# EAGLE schematic FTHR-Modified Schematic (EAGLE 9.6.2)
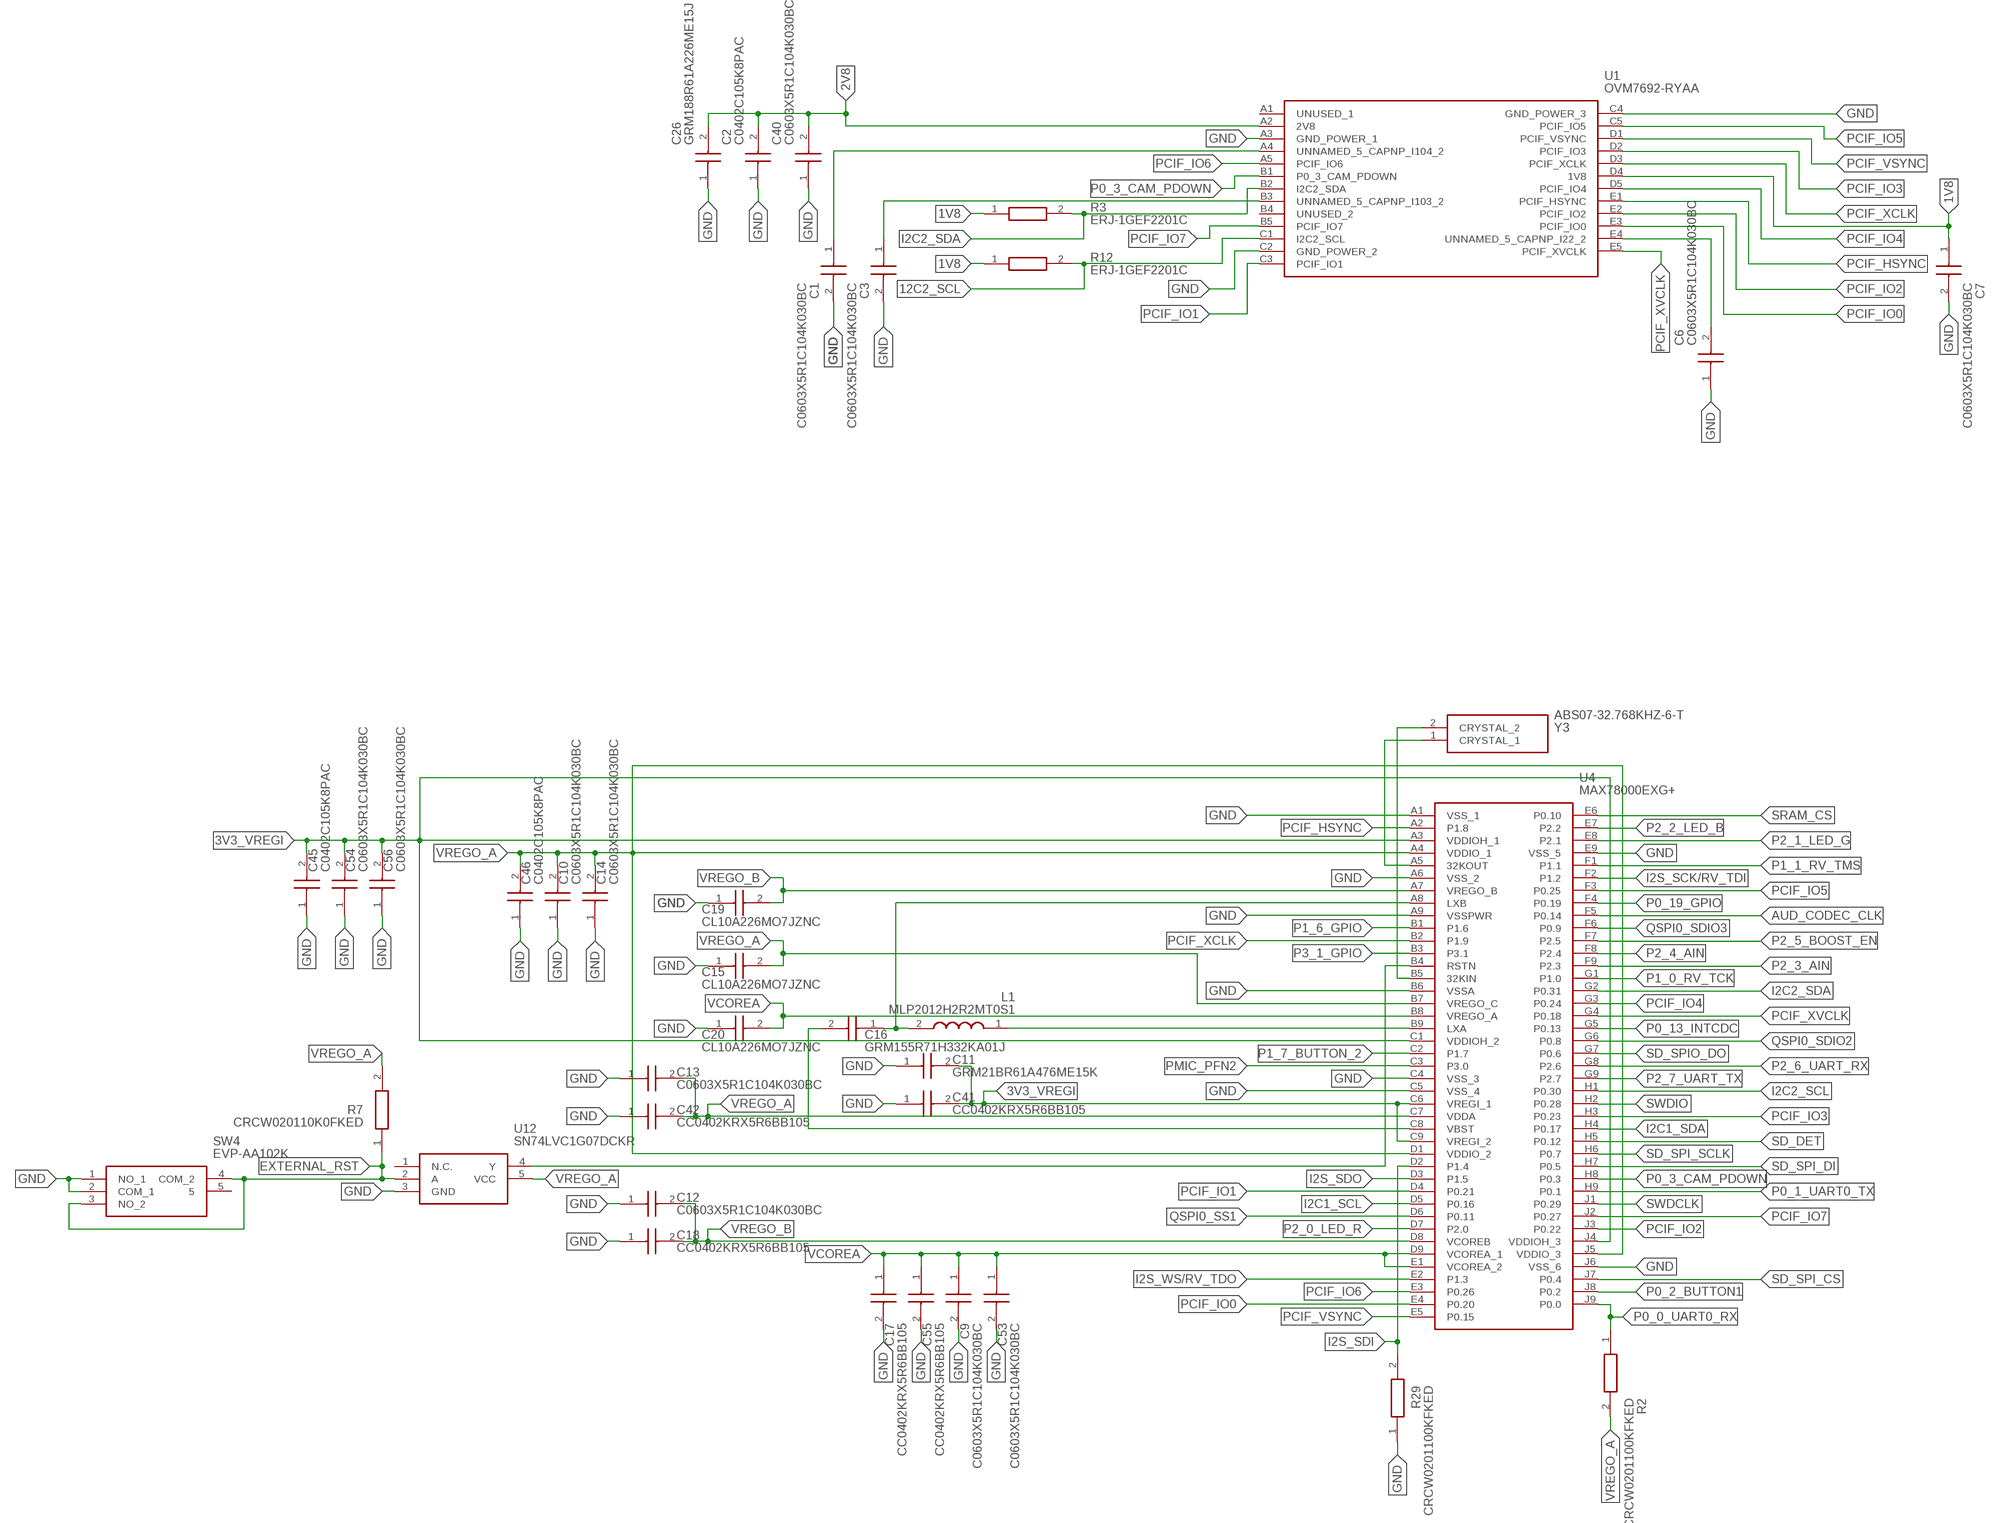
[diagram p0: schematic, sheet 1, part 1 of 3]
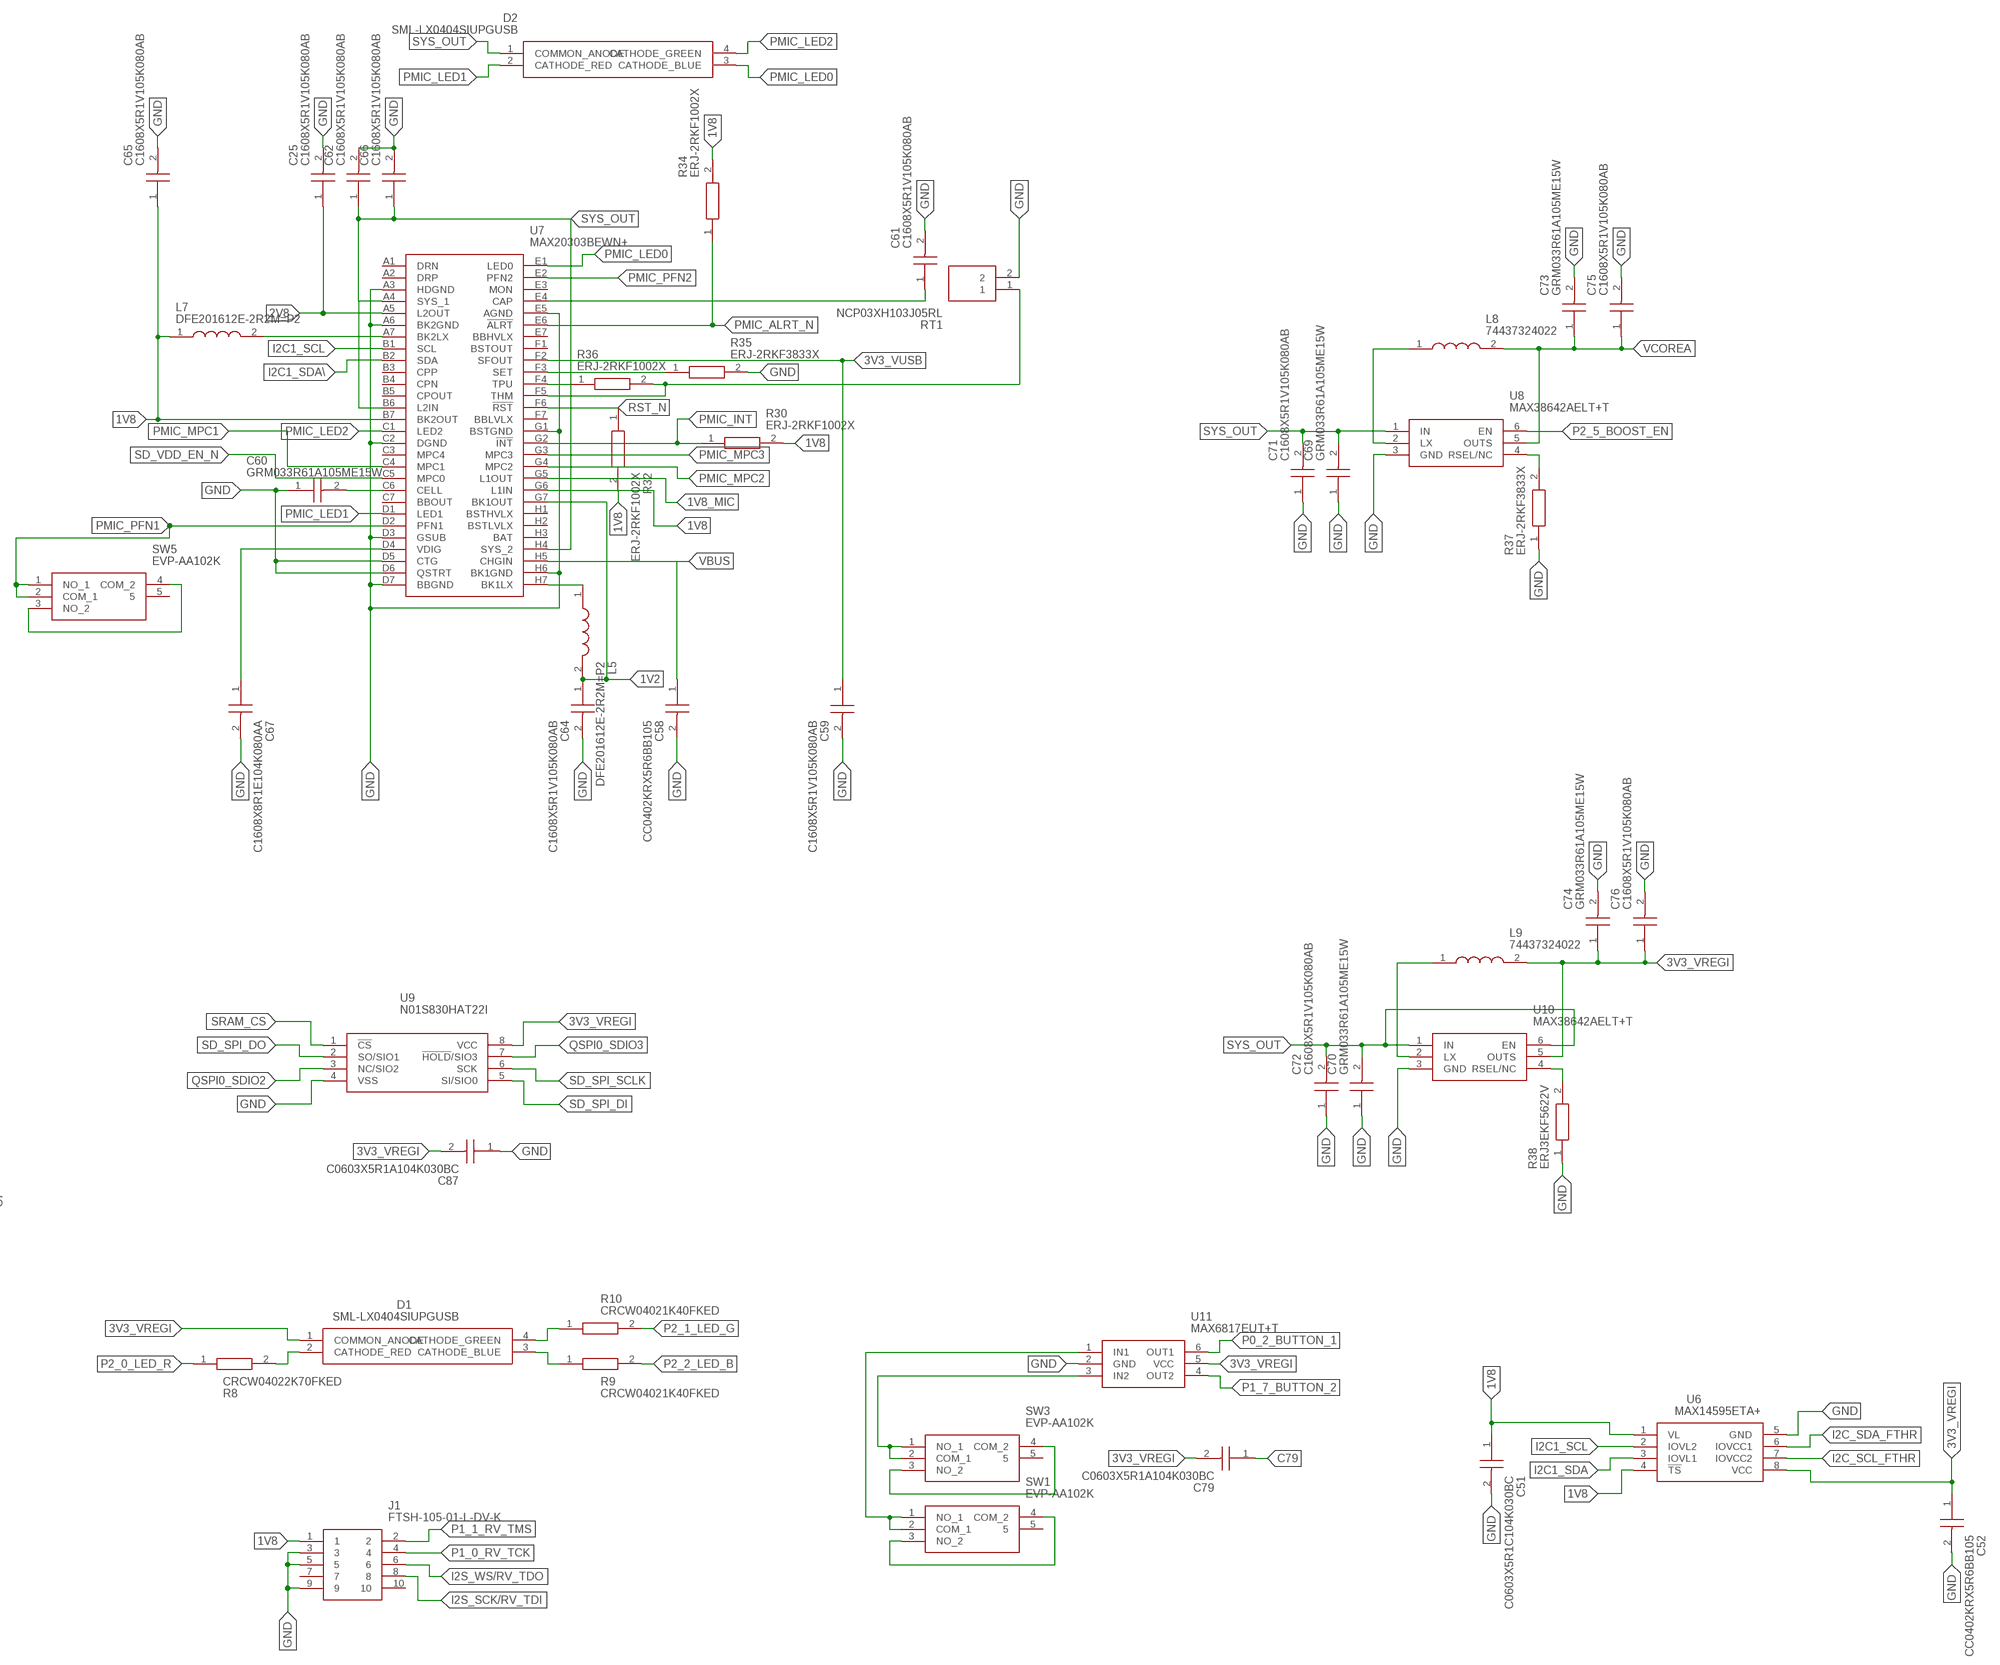
[diagram p1: schematic, sheet 1, part 2 of 3]
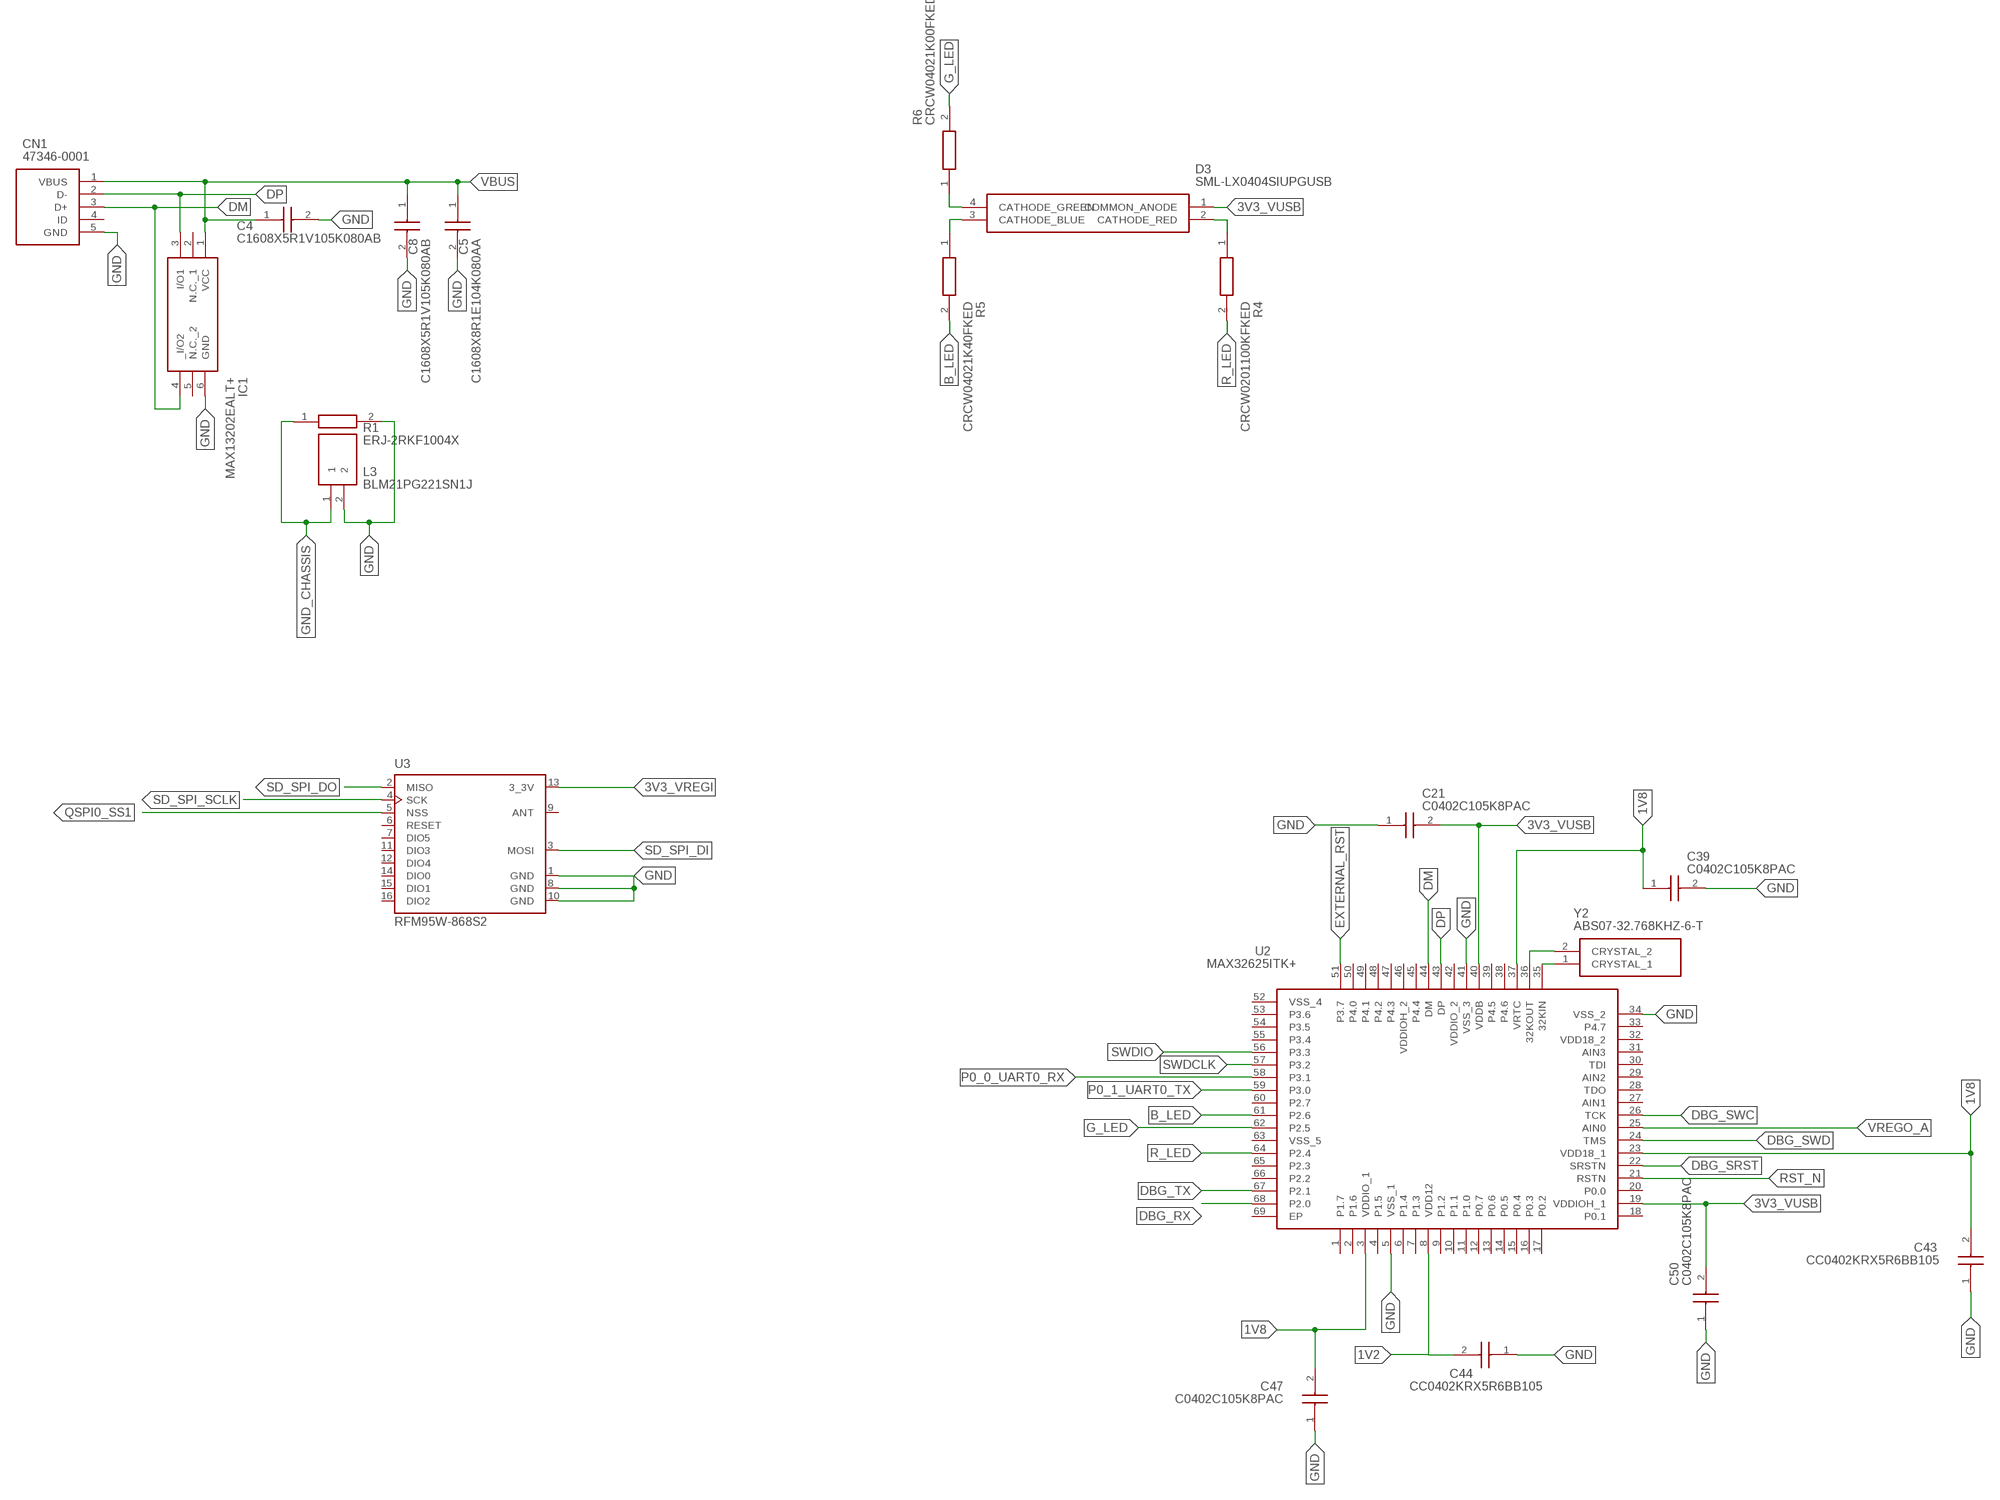
[diagram p2: schematic, sheet 1, part 3 of 3]

## Parts
C1  C0603X5R1C104K030BC  [C0603_COMMERCIAL]
C2  C0402C105K8PAC  [CAPC1005X55N]
C3  C0603X5R1C104K030BC  [C0603_COMMERCIAL]
C4  C1608X5R1V105K080AB  [C1608_COMMERCIAL]
C5  C1608X8R1E104K080AA  [C1608_COMMERCIAL]
C6  C0603X5R1C104K030BC  [C0603_COMMERCIAL]
C7  C0603X5R1C104K030BC  [C0603_COMMERCIAL]
C8  C1608X5R1V105K080AB  [C1608_COMMERCIAL]
C9  C0603X5R1C104K030BC  [C0603_COMMERCIAL]
C10  C0603X5R1C104K030BC  [C0603_COMMERCIAL]
C11  GRM21BR61A476ME15K  [CAPC2012X145N]
C12  C0603X5R1C104K030BC  [C0603_COMMERCIAL]
C13  C0603X5R1C104K030BC  [C0603_COMMERCIAL]
C14  C0603X5R1C104K030BC  [C0603_COMMERCIAL]
C15  CL10A226MO7JZNC  [CAPC1608X80N]
C16  GRM155R71H332KA01J  [CAPC1005X55N]
C17  CC0402KRX5R6BB105  [CAPC1005X55N]
C18  CC0402KRX5R6BB105  [CAPC1005X55N]
C19  CL10A226MO7JZNC  [CAPC1608X80N]
C20  CL10A226MO7JZNC  [CAPC1608X80N]
C21  C0402C105K8PAC  [CAPC1005X55N]
C25  C1608X5R1V105K080AB  [C1608_COMMERCIAL]
C26  GRM188R61A226ME15J  [CAPC1608X90N]
C39  C0402C105K8PAC  [CAPC1005X55N]
C40  C0603X5R1C104K030BC  [C0603_COMMERCIAL]
C41  CC0402KRX5R6BB105  [CAPC1005X55N]
C42  CC0402KRX5R6BB105  [CAPC1005X55N]
C43  CC0402KRX5R6BB105  [CAPC1005X55N]
C44  CC0402KRX5R6BB105  [CAPC1005X55N]
C45  C0402C105K8PAC  [CAPC1005X55N]
C46  C0402C105K8PAC  [CAPC1005X55N]
C47  C0402C105K8PAC  [CAPC1005X55N]
C50  C0402C105K8PAC  [CAPC1005X55N]
C51  C0603X5R1C104K030BC  [C0603_COMMERCIAL]
C52  CC0402KRX5R6BB105  [CAPC1005X55N]
C53  C0603X5R1C104K030BC  [C0603_COMMERCIAL]
C54  C0603X5R1C104K030BC  [C0603_COMMERCIAL]
C55  CC0402KRX5R6BB105  [CAPC1005X55N]
C56  C0603X5R1C104K030BC  [C0603_COMMERCIAL]
C58  CC0402KRX5R6BB105  [CAPC1005X55N]
C59  C1608X5R1V105K080AB  [C1608_COMMERCIAL]
C60  GRM033R61A105ME15W  [CAPC0603X33N]
C61  C1608X5R1V105K080AB  [C1608_COMMERCIAL]
C62  C1608X5R1V105K080AB  [C1608_COMMERCIAL]
C64  C1608X5R1V105K080AB  [C1608_COMMERCIAL]
C65  C1608X5R1V105K080AB  [C1608_COMMERCIAL]
C66  C1608X5R1V105K080AB  [C1608_COMMERCIAL]
C67  C1608X8R1E104K080AA  [C1608_COMMERCIAL]
C69  GRM033R61A105ME15W  [CAPC0603X33N]
C70  GRM033R61A105ME15W  [CAPC0603X33N]
C71  C1608X5R1V105K080AB  [C1608_COMMERCIAL]
C72  C1608X5R1V105K080AB  [C1608_COMMERCIAL]
C73  GRM033R61A105ME15W  [CAPC0603X33N]
C74  GRM033R61A105ME15W  [CAPC0603X33N]
C75  C1608X5R1V105K080AB  [C1608_COMMERCIAL]
C76  C1608X5R1V105K080AB  [C1608_COMMERCIAL]
C79  C0603X5R1A104K030BC  [C0603_COMMERCIAL]
C87  C0603X5R1A104K030BC  [C0603_COMMERCIAL]
CN1  47346-0001  [47346-0001]
D1  SML-LX0404SIUPGUSB  [SML-LX0404SIUPGUSB]
D2  SML-LX0404SIUPGUSB  [SML-LX0404SIUPGUSB]
D3  SML-LX0404SIUPGUSB  [SML-LX0404SIUPGUSB]
IC1  MAX13202EALT+  [MAX13202EALT]
J1  FTSH-105-01-L-DV-K  [FTSH10501LDVK]
L1  MLP2012H2R2MT0S1  [INDC2012X105N]
L3  BLM21PG221SN1J  [BLM21AG102BH1J]
L5  DFE201612E-2R2M=P2  [1286ASH1R0MP2]
L7  DFE201612E-2R2M=P2  [1286ASH1R0MP2]
L8  74437324022  [WE-LHMI_402048]
L9  74437324022  [WE-LHMI_402048]
R1  ERJ-2RKF1004X  [ERJ2R_(0402)]
R2  CRCW0201100KFKED  [RESC0603X28N]
R3  ERJ-1GEF2201C  [RESC0603X26N]
R4  CRCW0201100KFKED  [RESC0603X28N]
R5  CRCW04021K40FKED  [RESC1005X40N]
R6  CRCW04021K00FKED  [RESC1005X40N]
R7  CRCW020110K0FKED  [RESC0603X28N]
R8  CRCW04022K70FKED  [RESC1005X40N]
R9  CRCW04021K40FKED  [RESC1005X40N]
R10  CRCW04021K40FKED  [RESC1005X40N]
R12  ERJ-1GEF2201C  [RESC0603X26N]
R29  CRCW0201100KFKED  [RESC0603X28N]
R30  ERJ-2RKF1002X  [ERJ2R_(0402)]
R32  ERJ-2RKF1002X  [ERJ2R_(0402)]
R34  ERJ-2RKF1002X  [ERJ2R_(0402)]
R35  ERJ-2RKF3833X  [ERJ2R_(0402)]
R36  ERJ-2RKF1002X  [ERJ2R_(0402)]
R37  ERJ-2RKF3833X  [ERJ2R_(0402)]
R38  ERJ3EKF5622V  [ERJ3EK_(0603)]
RT1  NCP03XH103J05RL  [THRMC0603X33N]
SW1  EVP-AA102K  [EVPAA102K]
SW3  EVP-AA102K  [EVPAA102K]
SW4  EVP-AA102K  [EVPAA102K]
SW5  EVP-AA102K  [EVPAA102K]
U1  OVM7692-RYAA  [BGA25C50P5X5_347000X295000X276]
U2  MAX32625ITK+  [QFN40P800X800X80-69N]
U3  RFM95W-868S2  [XCVR_RFM95W-868S2]
U4  MAX78000EXG+  [BGA81C80P9X9_800X800X130]
U6  MAX14595ETA+  [MAX14595ETA]
U7  MAX20303BEWN+  [BGA56C50P7X8_368X418X69]
U8  MAX38642AELT+T  [MAX38642AELTT]
U9  N01S830HAT22I  [SOP65P640X110-8N]
U10  MAX38642AELT+T  [MAX38642AELTT]
U11  MAX6817EUT+T  [SOT95P280X145-6N]
U12  SN74LVC1G07DCKR  [SOT65P210X110-5N]
Y2  ABS07-32.768KHZ-6-T  [ABS0732768KHZ6T]
Y3  ABS07-32.768KHZ-6-T  [ABS0732768KHZ6T]

## Nets
1V2: C44.2 C64.1 L5.2 U2.8(VDD12) U7.G7(BK1OUT)
1V8: C7.1 C39.1 C43.2 C47.2 C51.1 C65.1 J1.1 L7.1 R3.1 R12.1 R30.2 R32.2 R34.2 U1.D4(1V8) U2.3(VDDIO_1) U2.23(VDD18_1) U2.37(VRTC) U6.1(VL) U6.4(!TS) U7.B7(BK2OUT) U7.G6(L1IN)
1V8_MIC: U7.G5(L1OUT)
2V8: C2.2 C25.1 C26.2 C40.2 U1.A2(2V8) U7.A5(L2OUT)
3V3_VREGI: C11.2 C41.2 C45.2 C52.1 C54.2 C56.2 C74.1 C76.1 C79.2 C87.2 D1.1(COMMON_ANODE) L9.2 U3.13(3_3V) U4.A3(VDDIOH_1) U4.C1(VDDIOH_2) U4.C6(VREGI_1) U4.C9(VREGI_2) U4.J4(VDDIOH_3) U6.8(VCC) U9.8(VCC) U10.5(OUTS) U11.5(VCC)
3V3_VUSB: C21.2 C50.2 C59.1 D3.1(COMMON_ANODE) U2.19(VDDIOH_1) U2.40(VDDB) U7.F2(SFOUT)
12C2_SCL: R12.2 U1.C1(I2C2_SCL)
AUD_CODEC_CLK: U4.F5(P0.14)
B_LED: R5.2 U2.61(P2.6)
C79: C79.1
DBG_RX: U2.68(P2.0)
DBG_SRST: U2.22(SRSTN)
DBG_SWC: U2.26(TCK)
DBG_SWD: U2.24(TMS)
DBG_TX: U2.67(P2.1)
DM: CN1.3(D+) IC1.4(_I/O2) U2.44(DM)
DP: CN1.2(D-) IC1.3(I/O1) U2.43(DP)
EXTERNAL_RST: R7.1 SW4.3(NO_2) SW4.4(COM_2) U2.51(P3.7) U12.2(A)
G_LED: R6.2 U2.62(P2.5)
GND: C1.2 C2.1 C3.2 C4.2 C5.2 C6.1 C7.2 C8.2 C9.2 C10.1 C11.1 C13.1 C14.1 C15.1 C17.2 C19.1 C20.1 C21.1 C25.2 C26.1 C39.2 C40.1 C41.1 C42.1 C43.1 C44.1 C45.1 C46.1 C47.1 C50.1 C51.2 C52.2 C53.2 C54.1 C55.2 C56.1 C58.2 C59.2 C60.1 C61.2 C62.2 C64.2 C65.2 C66.2 C67.2 C69.1 C70.1 C71.1 C72.1 C73.2 C74.2 C75.2 C76.2 C87.1 CN1.5(GND) IC1.6(GND) J1.3 J1.5 J1.9 L3.2 R1.2 R29.1 R35.1 R35.2 R37.1 R38.1 RT1.2 SW4.1(NO_1) SW4.2(COM_1) U1.A3(GND_POWER_1) U1.C2(GND_POWER_2) U1.C4(GND_POWER_3) U2.5(VSS_1) U2.34(VSS_2) U2.41(VSS_3) U3.1(GND) U3.8(GND) U3.10(GND) U4.A1(VSS_1) U4.A6(VSS_2) U4.A9(VSSPWR) U4.B6(VSSA) U4.C4(VSS_3) U4.C5(VSS_4) U4.E9(VSS_5) U4.J6(VSS_6) U6.5(GND) U7.A3(HDGND) U7.A6(BK2GND) U7.C2(DGND) U7.D3(GSUB) U7.D5(CTG) U7.D6(QSTRT) U7.D7(BBGND) U7.E5(AGND) U7.F3(SET) U7.G1(BSTGND) U7.H6(BK1GND) U8.3(GND) U9.4(VSS) U10.3(GND) U11.2(GND) U12.3(GND)
GND_CHASSIS: L3.1 R1.1
I2C1_SCL: U4.D5(P0.16) U6.2(IOVL2) U7.B1(SCL)
I2C1_SDA: U4.H4(P0.17) U6.3(IOVL1)
I2C1_SDA\: U7.B2(SDA)
I2C2_SCL: U4.H1(P0.30)
I2C2_SDA: R3.2 U1.B2(I2C2_SDA) U4.G2(P0.31)
I2C_SCL_FTHR: U6.7(IOVCC2)
I2C_SDA_FTHR: U6.6(IOVCC1)
I2S_SCK/RV_TDI: J1.8 U4.F2(P1.2)
I2S_SDI: R29.2 U4.D2(P1.4)
I2S_SDO: U4.D3(P1.5)
I2S_WS/RV_TDO: J1.6 U4.E2(P1.3)
N$1: U2.35(32KIN) Y2.1(CRYSTAL_1)
N$2: SW5.3(NO_2) SW5.4(COM_2)
N$3: C61.1 U7.E4(CAP)
N$4: R36.2 RT1.1 U7.F5(THM)
N$5: R36.1 U7.F4(TPU)
N$6: C67.1 U7.D4(VDIG)
N$7: L7.2 U7.A7(BK2LX)
N$8: R37.2 U8.4(RSEL/NC)
N$9: L5.1 U7.H7(BK1LX)
N$10: C60.2 U7.C6(CELL)
N$11: L8.1 U8.2(LX)
N$12: R38.2 U10.4(RSEL/NC)
N$13: L9.1 U10.2(LX)
N$14: SW3.1(NO_1) SW3.2(COM_1) U11.3(IN2)
N$15: SW1.1(NO_1) SW1.2(COM_1) U11.1(IN1)
N$16: SW3.3(NO_2) SW3.4(COM_2)
N$17: SW1.3(NO_2) SW1.4(COM_2)
N$18: C1.1 U1.A4(UNNAMED_5_CAPNP_I104_2)
N$19: C3.1 U1.B3(UNNAMED_5_CAPNP_I103_2)
N$20: D3.2(CATHODE_RED) R4.1
N$21: U4.A5(32KOUT) Y3.1(CRYSTAL_1)
N$22: C6.2 U1.E4(UNNAMED_5_CAPNP_I22_2)
N$23: U4.B5(32KIN) Y3.2(CRYSTAL_2)
N$24: C16.1 L1.2 U4.A8(LXB)
N$25: C16.2 U4.C8(VBST)
N$26: L1.1 U4.B9(LXA)
N$27: U4.B4(RSTN) U12.4(Y)
N$28: C12.1
N$29: C18.1
N$30: U2.36(32KOUT) Y2.2(CRYSTAL_2)
N$31: D3.3(CATHODE_BLUE) R5.1
N$32: D3.4(CATHODE_GREEN) R6.1
P0_0_UART0_RX: R2.1 U2.58(P3.1) U4.J9(P0.0)
P0_1_UART0_TX: U2.59(P3.0) U4.H9(P0.1)
P0_2_BUTTON1: U4.J8(P0.2)
P0_2_BUTTON_1: U11.6(OUT1)
P0_3_CAM_PDOWN: U1.B1(P0_3_CAM_PDOWN) U4.H8(P0.3)
P0_13_INTCDC: U4.G5(P0.13)
P0_19_GPIO: U4.F4(P0.19)
P1_0_RV_TCK: J1.4 U4.G1(P1.0)
P1_1_RV_TMS: J1.2 U4.F1(P1.1)
P1_6_GPIO: U4.B1(P1.6)
P1_7_BUTTON_2: U4.C2(P1.7) U11.4(OUT2)
P2_0_LED_R: D1.2(CATHODE_RED) R8.1 R8.2 U4.D7(P2.0)
P2_1_LED_G: D1.4(CATHODE_GREEN) R10.1 R10.2 U4.E8(P2.1)
P2_2_LED_B: D1.3(CATHODE_BLUE) R9.1 R9.2 U4.E7(P2.2)
P2_3_AIN: U4.F9(P2.3)
P2_4_AIN: U4.F8(P2.4)
P2_5_BOOST_EN: U4.F7(P2.5) U8.6(EN)
P2_6_UART_RX: U4.G8(P2.6)
P2_7_UART_TX: U4.G9(P2.7)
P3_1_GPIO: U4.B3(P3.1)
PCIF_HSYNC: U1.E1(PCIF_HSYNC) U4.A2(P1.8)
PCIF_IO0: U1.E3(PCIF_IO0) U4.E4(P0.20)
PCIF_IO1: U1.C3(PCIF_IO1) U4.D4(P0.21)
PCIF_IO2: U1.E2(PCIF_IO2) U4.J3(P0.22)
PCIF_IO3: U1.D2(PCIF_IO3) U4.H3(P0.23)
PCIF_IO4: U1.D5(PCIF_IO4) U4.G3(P0.24)
PCIF_IO5: U1.C5(PCIF_IO5) U4.F3(P0.25)
PCIF_IO6: U1.A5(PCIF_IO6) U4.E3(P0.26)
PCIF_IO7: U1.B5(PCIF_IO7) U4.J2(P0.27)
PCIF_VSYNC: U1.D1(PCIF_VSYNC) U4.E5(P0.15)
PCIF_XCLK: U1.D3(PCIF_XCLK) U4.B2(P1.9)
PCIF_XVCLK: U1.E5(PCIF_XVCLK) U4.G4(P0.18)
PMIC_ALRT_N: R34.1 U7.E6(!ALRT)
PMIC_INT: R30.1 U7.G2(!INT)
PMIC_LED0: D2.3(CATHODE_BLUE) U7.E1(LED0)
PMIC_LED1: D2.2(CATHODE_RED) U7.D1(LED1)
PMIC_LED2: D2.4(CATHODE_GREEN) U7.C1(LED2)
PMIC_MPC1: U7.C4(MPC1)
PMIC_MPC2: U7.G4(MPC2)
PMIC_MPC3: U7.G3(MPC3)
PMIC_PFN1: SW5.1(NO_1) SW5.2(COM_1) U7.D2(PFN1)
PMIC_PFN2: U4.C3(P3.0) U7.E2(PFN2)
QSPI0_SDIO2: U4.G6(P0.8) U9.3(NC/SIO2)
QSPI0_SDIO3: U4.F6(P0.9) U9.7(!HOLD!/SIO3)
QSPI0_SS1: U3.5(NSS) U4.D6(P0.11)
R_LED: R4.2 U2.64(P2.4)
RST_N: R32.1 U2.21(RSTN) U7.F6(!RST)
SD_DET: U4.H5(P0.12)
SD_SPI_CS: U4.J7(P0.4)
SD_SPI_DI: U3.3(MOSI) U4.H7(P0.5) U9.5(SI/SIO0)
SD_SPI_DO: U3.2(MISO) U9.2(SO/SIO1)
SD_SPI_SCLK: U3.4(SCK) U4.H6(P0.7) U9.6(SCK)
SD_SPIO_DO: U4.G7(P0.6)
SD_VDD_EN_N: U7.C5(MPC0)
SRAM_CS: U4.E6(P0.10) U9.1(!CS)
SWDCLK: U2.57(P3.2) U4.J1(P0.29)
SWDIO: U2.56(P3.3) U4.H2(P0.28)
SYS_OUT: C62.1 C66.1 C69.2 C70.2 C71.2 C72.2 D2.1(COMMON_ANODE) U7.A4(SYS_1) U7.B6(L2IN) U7.H4(SYS_2) U8.1(IN) U10.1(IN) U10.6(EN)
VBUS: C4.1 C5.1 C8.1 C58.1 CN1.1(VBUS) IC1.1(VCC) U7.H5(CHGIN)
VCOREA: C9.1 C17.1 C20.2 C53.1 C55.1 C73.1 C75.1 L8.2 U4.B8(VREGO_A) U4.D9(VCOREA_1) U4.E1(VCOREA_2) U8.5(OUTS)
VREGO_A: C10.2 C13.2 C14.2 C15.2 C42.2 C46.2 R2.2 R7.2 U2.25(AIN0) U4.A4(VDDIO_1) U4.B7(VREGO_C) U4.C7(VDDA) U4.D1(VDDIO_2) U4.J5(VDDIO_3) U12.5(VCC)
VREGO_B: C12.2 C18.2 C19.2 U4.A7(VREGO_B) U4.D8(VCOREB)
Unconnected: CN1.4(ID) IC1.2(N.C._1) IC1.5(N.C._2) J1.7 J1.10 SW1.5 SW3.5 SW4.5 SW5.5 U1.A1(UNUSED_1) U1.B4(UNUSED_2) U2.1(P1.7) U2.2(P1.6) U2.4(P1.5) U2.6(P1.4) U2.7(P1.3) U2.9(P1.2) U2.10(P1.1) U2.11(P1.0) U2.12(P0.7) U2.13(P0.6) U2.14(P0.5) U2.15(P0.4) U2.16(P0.3) U2.17(P0.2) U2.18(P0.1) U2.20(P0.0) U2.27(AIN1) U2.28(TDO) U2.29(AIN2) U2.30(TDI) U2.31(AIN3) U2.32(VDD18_2) U2.33(P4.7) U2.38(P4.6) U2.39(P4.5) U2.42(VDDIO_2) U2.45(P4.4) U2.46(VDDIOH_2) U2.47(P4.3) U2.48(P4.2) U2.49(P4.1) U2.50(P4.0) U2.52(VSS_4) U2.53(P3.6) U2.54(P3.5) U2.55(P3.4) U2.60(P2.7) U2.63(VSS_5) U2.65(P2.3) U2.66(P2.2) U2.69(EP) U3.6(RESET) U3.7(DIO5) U3.9(ANT) U3.11(DIO3) U3.12(DIO4) U3.14(DIO0) U3.15(DIO1) U3.16(DIO2) U7.A1(DRN) U7.A2(DRP) U7.B3(CPP) U7.B4(CPN) U7.B5(CPOUT) U7.C3(MPC4) U7.C7(BBOUT) U7.E3(MON) U7.E7(BBHVLX) U7.F1(BSTOUT) U7.F7(BBLVLX) U7.H1(BSTHVLX) U7.H2(BSTLVLX) U7.H3(BAT) U12.1(N.C.)

## Library data of the parts
C1 C3 C40 C51 = SamacSys_Parts:C0603X5R1C104K030BC: MULTILAYER CERAMIC CHIP CAPACITORS, 0603, Commercial grade, general (Up to 75V) Source: Datasheet <https://product.tdk.com/system/files/dam/doc/product/capacitor/ceramic/mlcc/catalog/mlcc_commercial_general_en.pdf>; ARROW_PART_NUMBER: C0603X5R1C104K030BC; ARROW_PRICE-STOCK: https://www.arrow.com/en/products/c0603x5r1c104k030bc/tdk?region=nac; DESCRIPTION: MULTILAYER CERAMIC CHIP CAPACITORS, 0603, Commercial grade, general (Up to 75V); HEIGHT: 0.33mm; MANUFACTURER_NAME: TDK; MANUFACTURER_PART_NUMBER: C0603X5R1C104K030BC; MOUSER_PART_NUMBER: 810-C0603X5R1C104KBC; MOUSER_PRICE-STOCK: https://www.mouser.co.uk/ProductDetail/TDK/C0603X5R1C104K030BC?qs=iuKcRwBk4Q%252BCmpTym6phKQ%3D%3D
C2 C21 C39 C47 C50 = SamacSys_Parts:C0402C105K8PAC: Multilayer Ceramic Capacitors MLCC - SMD/SMT 10volts 1uF 10% X5R Source: Datasheet <https://content.kemet.com/datasheets/KEM_C1002_X7R_SMD.pdf>; DESCRIPTION: Multilayer Ceramic Capacitors MLCC - SMD/SMT 10volts 1uF 10% X5R; HEIGHT: 0.55mm; MANUFACTURER_NAME: KEMET; MANUFACTURER_PART_NUMBER: C0402C105K8PAC; MOUSER_PART_NUMBER: 80-C0402C105K8PAC; MOUSER_PRICE-STOCK: https://www.mouser.co.uk/ProductDetail/KEMET/C0402C105K8PAC?qs=pIZUS6sqCWAp2JHK8JYcsQ%3D%3D
C4 C8 = PCB_Components:C1608X5R1V105K080AB: TDK 0603 C1608 1uF Ceramic Multilayer Capacitor, 35 V dc, +85C, X5R Dielectric Source: Datasheet <https://product.tdk.com/system/files/dam/doc/product/capacitor/ceramic/mlcc/catalog/mlcc_commercial_general_en.pdf>; DESCRIPTION: TDK 0603 C1608 1uF Ceramic Multilayer Capacitor, 35 V dc, +85C, X5R Dielectric; HEIGHT: 0.9mm; MANUFACTURER_NAME: TDK; MANUFACTURER_PART_NUMBER: C1608X5R1V105K080AB
C5 = PCB_Components:C1608X8R1E104K080AA: 0603 X8R ceramic capacitor 100nF 25V TDK 0603 C 100nF Ceramic Multilayer Capacitor, 25 V dc, +150C, X8R Dielectric, +/-10% SMD Source: Datasheet <https://product.tdk.com/system/files/dam/doc/product/capacitor/ceramic/mlcc/catalog/mlcc_commercial_hightemp_en.pdf>; ARROW_PART_NUMBER: C1608X8R1E104K080AA; ARROW_PRICE-STOCK: https://www.arrow.com/en/products/c1608x8r1e104k080aa/tdk; DESCRIPTION: 0603 X8R ceramic capacitor 100nF 25V TDK 0603 C 100nF Ceramic Multilayer Capacitor, 25 V dc, +150C, X8R Dielectric, +/-10% SMD; HEIGHT: 0.9mm; MANUFACTURER_NAME: TDK; MANUFACTURER_PART_NUMBER: C1608X8R1E104K080AA; MOUSER_PART_NUMBER: 810-C1608X8R1E104K; MOUSER_PRICE-STOCK: https://www.mouser.com/Search/Refine.aspx?Keyword=810-C1608X8R1E104K
C6 C7 C9 C10 C12-C14 C53 C54 C56 = PCB_Components:C0603X5R1C104K030BC: MULTILAYER CERAMIC CHIP CAPACITORS, 0603, Commercial grade, general (Up to 75V) Source: Datasheet <https://product.tdk.com/system/files/dam/doc/product/capacitor/ceramic/mlcc/catalog/mlcc_commercial_general_en.pdf>; ARROW_PART_NUMBER: C0603X5R1C104K030BC; ARROW_PRICE-STOCK: https://www.arrow.com/en/products/c0603x5r1c104k030bc/tdk?region=nac; DESCRIPTION: MULTILAYER CERAMIC CHIP CAPACITORS, 0603, Commercial grade, general (Up to 75V); HEIGHT: 0.33mm; MANUFACTURER_NAME: TDK; MANUFACTURER_PART_NUMBER: C0603X5R1C104K030BC; MOUSER_PART_NUMBER: 810-C0603X5R1C104KBC; MOUSER_PRICE-STOCK: https://www.mouser.co.uk/ProductDetail/TDK/C0603X5R1C104K030BC?qs=iuKcRwBk4Q%252BCmpTym6phKQ%3D%3D
C11 = PCB_Components:GRM21BR61A476ME15K: Multilayer Ceramic Capacitors MLCC - SMD/SMT 0805 47uF 10volts *Derate Voltage/Temp Source: Datasheet <https://datasheet.datasheetarchive.com/originals/distributors/DKDS42/DSANUWW0047682.pdf>; ARROW_PART_NUMBER: GRM21BR61A476ME15K; ARROW_PRICE-STOCK: https://www.arrow.com/en/products/grm21br61a476me15k/murata-manufacturing?region=nac; DESCRIPTION: Multilayer Ceramic Capacitors MLCC - SMD/SMT 0805 47uF 10volts *Derate Voltage/Temp; HEIGHT: 1.45mm; MANUFACTURER_NAME: Murata Electronics; MANUFACTURER_PART_NUMBER: GRM21BR61A476ME15K; MOUSER_PART_NUMBER: 81-GRM21BR61A476ME5K; MOUSER_PRICE-STOCK: https://www.mouser.co.uk/ProductDetail/Murata-Electronics/GRM21BR61A476ME15K?qs=hNud%2FORuBR153XPtoO6XtA%3D%3D
C15 C19 C20 = PCB_Components:CL10A226MO7JZNC: Multilayer Ceramic Capacitors MLCC - SMD/SMT 22uF+/-20% 16V X5R 1608 Source: Datasheet <https://www.mouser.es/datasheet/2/585/MLCC-1837944.pdf>; DESCRIPTION: Multilayer Ceramic Capacitors MLCC - SMD/SMT 22uF+/-20% 16V X5R 1608; HEIGHT: 0.8mm; MANUFACTURER_NAME: Samsung Electro-Mechanics; MANUFACTURER_PART_NUMBER: CL10A226MO7JZNC; MOUSER_PART_NUMBER: 187-CL10A226MO7JZNC; MOUSER_PRICE-STOCK: https://www.mouser.co.uk/ProductDetail/Samsung-Electro-Mechanics/CL10A226MO7JZNC?qs=xZ%2FP%252Ba9zWqb2i0I9rwAjeg%3D%3D
C16 = PCB_Components:GRM155R71H332KA01J: Multilayer Ceramic Capacitors MLCC - SMD/SMT 0.0033uF 50volts 10% Source: Datasheet <https://datasheet.datasheetarchive.com/originals/distributors/Datasheets_SAMA/ec4f1577dddcc7a13ddad897a28002d3.pdf>; DESCRIPTION: Multilayer Ceramic Capacitors MLCC - SMD/SMT 0.0033uF 50volts 10%; HEIGHT: 0.55mm; MANUFACTURER_NAME: Murata Electronics; MANUFACTURER_PART_NUMBER: GRM155R71H332KA01J; MOUSER_PART_NUMBER: 81-GRM155R71H332KA1J; MOUSER_PRICE-STOCK: https://www.mouser.com/Search/Refine.aspx?Keyword=81-GRM155R71H332KA1J
C17 C18 C41-C44 C55 = PCB_Components:CC0402KRX5R6BB105: General purpose & High capacitance Class 2, X5R Source: Datasheet <https://www.mouser.co.uk/datasheet/2/447/UPY-GPHC_X5R_4V-to-50V_25-1131599.pdf>; DESCRIPTION: General purpose & High capacitance Class 2, X5R; HEIGHT: 0.55mm; MANUFACTURER_NAME: YAGEO (PHYCOMP); MANUFACTURER_PART_NUMBER: CC0402KRX5R6BB105; MOUSER_PART_NUMBER: 603-CC402KRX5R6BB105; MOUSER_PRICE-STOCK: https://www.mouser.co.uk/ProductDetail/YAGEO/CC0402KRX5R6BB105?qs=BKNoF%2F0xMNu0TvpE6ze2Iw%3D%3D
C25 C59 C61 C62 C64-C66 C71 C72 C75 C76 = SamacSys_Parts:C1608X5R1V105K080AB: TDK 0603 C1608 1uF Ceramic Multilayer Capacitor, 35 V dc, +85C, X5R Dielectric Source: Datasheet <https://product.tdk.com/system/files/dam/doc/product/capacitor/ceramic/mlcc/catalog/mlcc_commercial_general_en.pdf>; DESCRIPTION: TDK 0603 C1608 1uF Ceramic Multilayer Capacitor, 35 V dc, +85C, X5R Dielectric; HEIGHT: 0.9mm; MANUFACTURER_NAME: TDK; MANUFACTURER_PART_NUMBER: C1608X5R1V105K080AB
C26 = SamacSys_Parts:GRM188R61A226ME15J: Multilayer Ceramic Capacitors MLCC - SMD/SMT 0603 22uF 10volts *Derate Voltage/Temp Source: Datasheet <http://componentsearchengine.com/Datasheets/1/GRM188R61A226ME15J.pdf>; ARROW_PART_NUMBER: GRM188R61A226ME15J; ARROW_PRICE-STOCK: https://www.arrow.com/en/products/grm188r61a226me15j/murata-manufacturing; DESCRIPTION: Multilayer Ceramic Capacitors MLCC - SMD/SMT 0603 22uF 10volts *Derate Voltage/Temp; HEIGHT: 0.9mm; MANUFACTURER_NAME: Murata Electronics; MANUFACTURER_PART_NUMBER: GRM188R61A226ME15J; MOUSER_PART_NUMBER: 81-GRM188R61A226ME5J; MOUSER_PRICE-STOCK: https://www.mouser.co.uk/ProductDetail/Murata-Electronics/GRM188R61A226ME15J?qs=QzBtWTOodeUZmjqoH8BLhQ%3D%3D
C45 C46 = PCB_Components:C0402C105K8PAC: Multilayer Ceramic Capacitors MLCC - SMD/SMT 10volts 1uF 10% X5R Source: Datasheet <https://content.kemet.com/datasheets/KEM_C1002_X7R_SMD.pdf>; DESCRIPTION: Multilayer Ceramic Capacitors MLCC - SMD/SMT 10volts 1uF 10% X5R; HEIGHT: 0.55mm; MANUFACTURER_NAME: KEMET; MANUFACTURER_PART_NUMBER: C0402C105K8PAC; MOUSER_PART_NUMBER: 80-C0402C105K8PAC; MOUSER_PRICE-STOCK: https://www.mouser.co.uk/ProductDetail/KEMET/C0402C105K8PAC?qs=pIZUS6sqCWAp2JHK8JYcsQ%3D%3D
C52 C58 = SamacSys_Parts:CC0402KRX5R6BB105: General purpose & High capacitance Class 2, X5R Source: Datasheet <https://www.mouser.co.uk/datasheet/2/447/UPY-GPHC_X5R_4V-to-50V_25-1131599.pdf>; DESCRIPTION: General purpose & High capacitance Class 2, X5R; HEIGHT: 0.55mm; MANUFACTURER_NAME: YAGEO (PHYCOMP); MANUFACTURER_PART_NUMBER: CC0402KRX5R6BB105; MOUSER_PART_NUMBER: 603-CC402KRX5R6BB105; MOUSER_PRICE-STOCK: https://www.mouser.co.uk/ProductDetail/YAGEO/CC0402KRX5R6BB105?qs=BKNoF%2F0xMNu0TvpE6ze2Iw%3D%3D
C60 C69 C70 C73 C74 = SamacSys_Parts:GRM033R61A105ME15W: Capacitor GRM03_0.09 L=0.6mm W=0.3mm T=0.3mm Source: Datasheet <https://psearch.en.murata.com/capacitor/product/GRM033R61A105ME15#.html>; DESCRIPTION: Capacitor GRM03_0.09 L=0.6mm W=0.3mm T=0.3mm; HEIGHT: 0.33mm; MANUFACTURER_NAME: Murata Electronics; MANUFACTURER_PART_NUMBER: GRM033R61A105ME15W
C67 = SamacSys_Parts:C1608X8R1E104K080AA: 0603 X8R ceramic capacitor 100nF 25V TDK 0603 C 100nF Ceramic Multilayer Capacitor, 25 V dc, +150C, X8R Dielectric, +/-10% SMD Source: Datasheet <https://product.tdk.com/system/files/dam/doc/product/capacitor/ceramic/mlcc/catalog/mlcc_commercial_hightemp_en.pdf>; ARROW_PART_NUMBER: C1608X8R1E104K080AA; ARROW_PRICE-STOCK: https://www.arrow.com/en/products/c1608x8r1e104k080aa/tdk; DESCRIPTION: 0603 X8R ceramic capacitor 100nF 25V TDK 0603 C 100nF Ceramic Multilayer Capacitor, 25 V dc, +150C, X8R Dielectric, +/-10% SMD; HEIGHT: 0.9mm; MANUFACTURER_NAME: TDK; MANUFACTURER_PART_NUMBER: C1608X8R1E104K080AA; MOUSER_PART_NUMBER: 810-C1608X8R1E104K; MOUSER_PRICE-STOCK: https://www.mouser.com/Search/Refine.aspx?Keyword=810-C1608X8R1E104K
C79 C87 = SamacSys_Parts:C0603X5R1A104K030BC: TDK 100nF Multilayer Ceramic Capacitor MLCC 10V dc +/-10% X5R Dielectric 0201 (0603M) SMD, Max. Temp. +85C Source: Datasheet <https://product.tdk.com/system/files/dam/doc/product/capacitor/ceramic/mlcc/catalog/mlcc_commercial_general_en.pdf>; DESCRIPTION: TDK 100nF Multilayer Ceramic Capacitor MLCC 10V dc +/-10% X5R Dielectric 0201 (0603M) SMD, Max. Temp. +85C; HEIGHT: 0.33mm; MANUFACTURER_NAME: TDK; MANUFACTURER_PART_NUMBER: C0603X5R1A104K030BC; MOUSER_PART_NUMBER: 810-C0603X5R1A104KBC; MOUSER_PRICE-STOCK: https://www.mouser.co.uk/ProductDetail/TDK/C0603X5R1A104K030BC?qs=iuKcRwBk4Q9oKEkZhm4vZQ%3D%3D
CN1 = PCB_Components:47346-0001: Micro USB B Receptacle Bottom Mount Assy Molex Right Angle SMT Type B Version 2.0 Micro USB Connector Socket, 30 V ac, 1A 47352 MICRO-USB Source: Datasheet <http://www.molex.com/pdm_docs/sd/473460001_sd.pdf>; DESCRIPTION: Micro USB B Receptacle Bottom Mount Assy Molex Right Angle SMT Type B Version 2.0 Micro USB Connector Socket, 30 V ac, 1A 47352 MICRO-USB; HEIGHT: mm; MANUFACTURER_NAME: Molex; MANUFACTURER_PART_NUMBER: 47346-0001; MOUSER_PART_NUMBER: 538-47346-0001; MOUSER_PRICE-STOCK: https://www.mouser.co.uk/ProductDetail/Molex/47346-0001?qs=c2CV6XM0DweJBWaSeyWeCw%3D%3D
D1-D3 = SamacSys_Parts:SML-LX0404SIUPGUSB: LED,0404,Surface Mount,QuasarBrite Lumex SML-LX0404SIUPGUSB RGB LED, 465 (Blue) nm, 518 (Green) nm, 632 (Red) nm 0404 Clear, Rectangle Lens SMD package Source: Datasheet <https://datasheet.datasheetarchive.com/originals/distributors/Datasheets-DGA13/1153815.pdf>; ARROW_PART_NUMBER: SML-LX0404SIUPGUSB; ARROW_PRICE-STOCK: https://www.arrow.com/en/products/sml-lx0404siupgusb/lumex; DESCRIPTION: LED,0404,Surface Mount,QuasarBrite Lumex SML-LX0404SIUPGUSB RGB LED, 465 (Blue) nm, 518 (Green) nm, 632 (Red) nm 0404 Clear, Rectangle Lens SMD package; HEIGHT: mm; MANUFACTURER_NAME: Lumex; MANUFACTURER_PART_NUMBER: SML-LX0404SIUPGUSB; MOUSER_PART_NUMBER: 696-LX0404SIUPGUSB; MOUSER_PRICE-STOCK: https://www.mouser.co.uk/ProductDetail/Lumex/SML-LX0404SIUPGUSB?qs=iPumNTI%2F3jXoZkWlWVrBPw%3D%3D
IC1 = PCB_Components:MAX13202EALT+: TVS DIODE 6UDFN Source: Datasheet <https://pdfserv.maximintegrated.com/en/ds/MAX13202E-MAX13208E.pdf>; DESCRIPTION: TVS DIODE 6UDFN; HEIGHT: 0.8mm; MANUFACTURER_NAME: Maxim Integrated; MANUFACTURER_PART_NUMBER: MAX13202EALT+
J1 = PCB_Components:FTSH-105-01-L-DV-K: Samtec, FTSH, 10 Way, 2 Row, Straight Pin Header Source: Datasheet <https://www.arrow.com/en/products/ftsh-105-01-l-dv-k/samtec>; ARROW_PART_NUMBER: FTSH-105-01-L-DV-K; ARROW_PRICE-STOCK: https://www.arrow.com/en/products/ftsh-105-01-l-dv-k/samtec?region=europe; DESCRIPTION: Samtec, FTSH, 10 Way, 2 Row, Straight Pin Header; HEIGHT: 6.1mm; MANUFACTURER_NAME: SAMTEC; MANUFACTURER_PART_NUMBER: FTSH-105-01-L-DV-K; MOUSER_PART_NUMBER: 200-FTSH10501LDVK; MOUSER_PRICE-STOCK: https://www.mouser.co.uk/ProductDetail/Samtec/FTSH-105-01-L-DV-K?qs=%252B5JSS813miOqo3Vy%252BvhCFg%3D%3D
L1 = PCB_Components:MLP2012H2R2MT0S1: Inductor Power Shielded Multi-Layer 2.2uH 20% 2MHz Ferrite 1A 195mOhm DCR 0805 T/R Source: Datasheet <https://product.tdk.com/system/files/dam/doc/product/inductor/inductor/smd/catalog/inductor_commercial_power_mlp2012_en.pdf>; ARROW_PART_NUMBER: MLP2012H2R2MT0S1; ARROW_PRICE-STOCK: https://www.arrow.com/en/products/mlp2012h2r2mt0s1/tdk; DESCRIPTION: Inductor Power Shielded Multi-Layer 2.2uH 20% 2MHz Ferrite 1A 195mOhm DCR 0805 T/R; HEIGHT: 1.05mm; MANUFACTURER_NAME: TDK; MANUFACTURER_PART_NUMBER: MLP2012H2R2MT0S1; MOUSER_PART_NUMBER: 810-MLP2012H2R2MT0S1; MOUSER_PRICE-STOCK: https://www.mouser.co.uk/ProductDetail/TDK/MLP2012H2R2MT0S1?qs=%2FPzWLGNeQ%252BgQ1f6yrO9reg%3D%3D
L3 = PCB_Components:BLM21PG221SN1J: BLM21_N1J Series EMI Suppression Filter 220+/-25% at 100MHz 2A @85 Source: Datasheet <https://www.murata.com/en-us/products/productdetail?partno=BLM21PG221SN1#>; DESCRIPTION: BLM21_N1J Series EMI Suppression Filter 220+/-25% at 100MHz 2A @85; HEIGHT: 1.05mm; MANUFACTURER_NAME: Murata Electronics; MANUFACTURER_PART_NUMBER: BLM21PG221SN1J; MOUSER_PART_NUMBER: N/A; MOUSER_PRICE-STOCK: https://www.mouser.com/Search/Refine.aspx?Keyword=N%2FA
L5 L7 = SamacSys_Parts:DFE201612E-2R2M=P2: DFE201612E Series Inductor 2.2uH +/-20% 0806 (2016) Source: Datasheet <https://psearch.en.murata.com/inductor/product/DFE201612E-2R2M#.html>; ARROW_PART_NUMBER: DFE201612E-2R2M=P2; ARROW_PRICE-STOCK: https://www.arrow.com/en/products/dfe201612e-2r2mp2/murata-manufacturing?region=nac; DESCRIPTION: DFE201612E Series Inductor 2.2uH +/-20% 0806 (2016); HEIGHT: 1.2mm; MANUFACTURER_NAME: Murata Electronics; MANUFACTURER_PART_NUMBER: DFE201612E-2R2M=P2; MOUSER_PART_NUMBER: 81-DFE201612E-2R2MP2; MOUSER_PRICE-STOCK: https://www.mouser.co.uk/ProductDetail/Murata-Electronics/DFE201612E-2R2M%3dP2?qs=AQlKX63v8Rsi4vow61OBVg%3D%3D
L8 L9 = SamacSys_Parts:74437324022: SMD Power Inductor WE-LHMI Source: Datasheet <http://componentsearchengine.com/Datasheets/1/74437324022.pdf>; DESCRIPTION: SMD Power Inductor WE-LHMI; HEIGHT: mm; MANUFACTURER_NAME: Wurth Elektronik; MANUFACTURER_PART_NUMBER: 74437324022; MOUSER_PART_NUMBER: 710-74437324022; MOUSER_PRICE-STOCK: https://www.mouser.co.uk/ProductDetail/Wurth-Elektronik/74437324022?qs=cFlH0mFHHFpwW2%2Fr4GrfyQ%3D%3D
R1 = PCB_Components:ERJ-2RKF1004X: Precision Thick Film Chip Resistor, 0402, 0.063W Source: Datasheet <http://industrial.panasonic.com/cdbs/www-data/pdf/RDA0000/AOA0000C304.pdf>; ARROW_PART_NUMBER: ERJ-2RKF1004X; ARROW_PRICE-STOCK: https://www.arrow.com/en/products/erj-2rkf1004x/panasonic; DESCRIPTION: Precision Thick Film Chip Resistor, 0402, 0.063W; HEIGHT: 0.4mm; MANUFACTURER_NAME: Panasonic; MANUFACTURER_PART_NUMBER: ERJ-2RKF1004X; MOUSER_PART_NUMBER: 667-ERJ-2RKF1004X; MOUSER_PRICE-STOCK: https://www.mouser.co.uk/ProductDetail/Panasonic/ERJ-2RKF1004X?qs=H7k1u0Mp9JTG%252BclS6LVdqw%3D%3D
R2 R29 = PCB_Components:CRCW0201100KFKED: Thick Film Resistors - SMD 1/20watt 100Kohms 1% 100ppm Source: Datasheet <http://www.vishay.com/docs/20035/dcrcwe3.pdf>; ARROW_PART_NUMBER: CRCW0201100KFKED; ARROW_PRICE-STOCK: https://www.arrow.com/en/products/crcw0201100kfked/vishay; DESCRIPTION: Thick Film Resistors - SMD 1/20watt 100Kohms 1% 100ppm; HEIGHT: 0.28mm; MANUFACTURER_NAME: Vishay; MANUFACTURER_PART_NUMBER: CRCW0201100KFKED; MOUSER_PART_NUMBER: 71-CRCW0201100KFKED; MOUSER_PRICE-STOCK: https://www.mouser.co.uk/ProductDetail/Vishay-Dale/CRCW0201100KFKED?qs=IQLUlsvFoXv777MvAg0vmg%3D%3D
R3 R12 = PCB_Components:ERJ-1GEF2201C: Thick Film Resistors - SMD RECOMMENDED ALT 667-ERJ-1GNF2201C Source: Datasheet <https://media.digikey.com/pdf/Data Sheets/Panasonic Electronic Components/ERG-x_Precision_Thick_Film_DS.pdf>; DESCRIPTION: Thick Film Resistors - SMD RECOMMENDED ALT 667-ERJ-1GNF2201C; HEIGHT: 0.26mm; MANUFACTURER_NAME: Panasonic; MANUFACTURER_PART_NUMBER: ERJ-1GEF2201C; MOUSER_PART_NUMBER: 667-ERJ-1GEF2201C; MOUSER_PRICE-STOCK: https://www.mouser.co.uk/ProductDetail/Panasonic/ERJ-1GEF2201C?qs=m25IEBrbWUyyQyMsjCoUZw%3D%3D
R4 = SamacSys_Parts:CRCW0201100KFKED: Thick Film Resistors - SMD 1/20watt 100Kohms 1% 100ppm Source: Datasheet <http://www.vishay.com/docs/20035/dcrcwe3.pdf>; ARROW_PART_NUMBER: CRCW0201100KFKED; ARROW_PRICE-STOCK: https://www.arrow.com/en/products/crcw0201100kfked/vishay; DESCRIPTION: Thick Film Resistors - SMD 1/20watt 100Kohms 1% 100ppm; HEIGHT: 0.28mm; MANUFACTURER_NAME: Vishay; MANUFACTURER_PART_NUMBER: CRCW0201100KFKED; MOUSER_PART_NUMBER: 71-CRCW0201100KFKED; MOUSER_PRICE-STOCK: https://www.mouser.co.uk/ProductDetail/Vishay-Dale/CRCW0201100KFKED?qs=IQLUlsvFoXv777MvAg0vmg%3D%3D
R5 R9 R10 = SamacSys_Parts:CRCW04021K40FKED: Vishay CRCW Series Thick Film Surface Mount Resistor 0402 Case 1.4k +/-1% 0.063W +/-100ppm/C Source: Datasheet <http://www.vishay.com/docs/20035/dcrcwe3.pdf>; ARROW_PART_NUMBER: CRCW04021K40FKED; ARROW_PRICE-STOCK: https://www.arrow.com/en/products/crcw04021k40fked/vishay; DESCRIPTION: Vishay CRCW Series Thick Film Surface Mount Resistor 0402 Case 1.4k +/-1% 0.063W +/-100ppm/C; HEIGHT: 0.4mm; MANUFACTURER_NAME: Vishay; MANUFACTURER_PART_NUMBER: CRCW04021K40FKED; MOUSER_PART_NUMBER: 71-CRCW0402-1.4K-E3; MOUSER_PRICE-STOCK: https://www.mouser.co.uk/ProductDetail/Vishay-Dale/CRCW04021K40FKED?qs=YX%252BK5oaHNYr2QOB5JgCy2Q%3D%3D
R6 = SamacSys_Parts:CRCW04021K00FKED: CRCW0402 Resistor T/R 0.063W,1%,1K Vishay CRCW Series Thick Film Surface Mount Resistor 0402 Case 1kOhm /-1% 0.063W /-100ppm/degC Source: Datasheet <http://www.vishay.com/docs/20035/dcrcwe3.pdf>; ARROW_PART_NUMBER: CRCW04021K00FKED; ARROW_PRICE-STOCK: https://www.arrow.com/en/products/crcw04021k00fked/vishay?region=nac; DESCRIPTION: CRCW0402 Resistor T/R 0.063W,1%,1K Vishay CRCW Series Thick Film Surface Mount Resistor 0402 Case 1kOhm /-1% 0.063W /-100ppm/degC; HEIGHT: 0.4mm; MANUFACTURER_NAME: Vishay; MANUFACTURER_PART_NUMBER: CRCW04021K00FKED; MOUSER_PART_NUMBER: 71-CRCW0402-1.0K-E3; MOUSER_PRICE-STOCK: https://www.mouser.co.uk/ProductDetail/Vishay-Dale/CRCW04021K00FKED?qs=YX%252BK5oaHNYqQ2WK%252BIAW12A%3D%3D
R7 = PCB_Components:CRCW020110K0FKED: Thick Film Resistors - SMD 1/20watt 10Kohms 1% 100ppm Source: Datasheet <http://www.vishay.com/docs/20035/dcrcwe3.pdf>; ARROW_PART_NUMBER: CRCW020110K0FKED; ARROW_PRICE-STOCK: https://www.arrow.com/en/products/crcw020110k0fked/vishay; DESCRIPTION: Thick Film Resistors - SMD 1/20watt 10Kohms 1% 100ppm; HEIGHT: 0.28mm; MANUFACTURER_NAME: Vishay; MANUFACTURER_PART_NUMBER: CRCW020110K0FKED; MOUSER_PART_NUMBER: 71-CRCW020110K0FKED; MOUSER_PRICE-STOCK: https://www.mouser.co.uk/ProductDetail/Vishay-Dale/CRCW020110K0FKED?qs=IQLUlsvFoXt4VKfnHO9iyg%3D%3D
R8 = SamacSys_Parts:CRCW04022K70FKED: Vishay CRCW Series Thick Film Surface Mount Resistor 0402 Case 2.7k +/-1% 0.063W +/-100ppm/C Source: Datasheet <http://www.vishay.com/docs/20035/dcrcwe3.pdf>; ARROW_PART_NUMBER: CRCW04022K70FKED; ARROW_PRICE-STOCK: http://www.arrow.com/en/products/crcw04022k70fked/vishay; DESCRIPTION: Vishay CRCW Series Thick Film Surface Mount Resistor 0402 Case 2.7k +/-1% 0.063W +/-100ppm/C; HEIGHT: 0.4mm; MANUFACTURER_NAME: Vishay; MANUFACTURER_PART_NUMBER: CRCW04022K70FKED; MOUSER_PART_NUMBER: 71-CRCW0402-2.7K-E3; MOUSER_PRICE-STOCK: https://www.mouser.co.uk/ProductDetail/Vishay-Dale/CRCW04022K70FKED?qs=Jz%252BxJjKhzTw0Qm89fg3bzw%3D%3D
R30 R32 R34 R36 = SamacSys_Parts:ERJ-2RKF1002X: Res Thick Film 0402 10K Ohm 1% 0.1W(1/10W) +/-100ppm/C Pad SMD Automotive T/R Source: Datasheet <http://industrial.panasonic.com/cdbs/www-data/pdf/RDA0000/AOA0000C304.pdf>; ARROW_PART_NUMBER: ERJ-2RKF1002X; ARROW_PRICE-STOCK: https://www.arrow.com/en/products/erj-2rkf1002x/panasonic?region=nac; DESCRIPTION: Res Thick Film 0402 10K Ohm 1% 0.1W(1/10W) +/-100ppm/C Pad SMD Automotive T/R; HEIGHT: 0.4mm; MANUFACTURER_NAME: Panasonic; MANUFACTURER_PART_NUMBER: ERJ-2RKF1002X; MOUSER_PART_NUMBER: 667-ERJ-2RKF1002X; MOUSER_PRICE-STOCK: https://www.mouser.co.uk/ProductDetail/Panasonic/ERJ-2RKF1002X?qs=H7k1u0Mp9JRzR4nj0ZFtQQ%3D%3D
R35 R37 = SamacSys_Parts:ERJ-2RKF3833X: Precision Thick Film Chip Resistor, 0402, 0.063W Source: Datasheet <http://industrial.panasonic.com/cdbs/www-data/pdf/RDA0000/AOA0000C304.pdf>; DESCRIPTION: Precision Thick Film Chip Resistor, 0402, 0.063W; HEIGHT: 0.4mm; MANUFACTURER_NAME: Panasonic; MANUFACTURER_PART_NUMBER: ERJ-2RKF3833X; MOUSER_PART_NUMBER: 667-ERJ-2RKF3833X; MOUSER_PRICE-STOCK: https://www.mouser.com/Search/ProductDetail.aspx?qs=YMBIwoNQYdWxM8g%2fDHZHQg%3d%3d
R38 = SamacSys_Parts:ERJ3EKF5622V: Panasonic E96 Series Precision Thick Film Surface Mount Fixed Resistor 0603 Case 56.2k +/-1% 0.1W +/-100ppm/C Source: Datasheet <https://industrial.panasonic.com/cdbs/www-data/pdf/RDA0000/AOA0000C304.pdf>; DESCRIPTION: Panasonic E96 Series Precision Thick Film Surface Mount Fixed Resistor 0603 Case 56.2k +/-1% 0.1W +/-100ppm/C; HEIGHT: 0.55mm; MANUFACTURER_NAME: Panasonic; MANUFACTURER_PART_NUMBER: ERJ3EKF5622V
RT1 = SamacSys_Parts:NCP03XH103J05RL: NCP03X NTC SMD 0201 Thermistor 10K 1% Source: Datasheet <https://www.murata.com/~/media/webrenewal/support/library/catalog/products/thermistor/ntc/r44e.ashx?la=en-us>; ARROW_PART_NUMBER: NCP03XH103J05RL; ARROW_PRICE-STOCK: https://www.arrow.com/en/products/ncp03xh103j05rl/murata-manufacturing; DESCRIPTION: NCP03X NTC SMD 0201 Thermistor 10K 1%; HEIGHT: 0.33mm; MANUFACTURER_NAME: Murata Electronics; MANUFACTURER_PART_NUMBER: NCP03XH103J05RL; MOUSER_PART_NUMBER: 81-NCP03XH103J05RL; MOUSER_PRICE-STOCK: https://www.mouser.co.uk/ProductDetail/Murata-Electronics/NCP03XH103J05RL?qs=Ph123%2FQKYiRwnoJocneXPA%3D%3D
SW1 SW3 SW5 = SamacSys_Parts:EVP-AA102K: Black Push Plate Tact Switch, SPST 20 mA @ 15 V dc 2.2mm Surface Mount Source: Datasheet <https://industrial.panasonic.com/cdbs/www-data/pdf/ATK0000/ATK0000COS4238.pdf>; DESCRIPTION: Black Push Plate Tact Switch, SPST 20 mA @ 15 V dc 2.2mm Surface Mount; HEIGHT: 1.9mm; MANUFACTURER_NAME: Panasonic; MANUFACTURER_PART_NUMBER: EVP-AA102K; MOUSER_PART_NUMBER: 667-EVP-AA102K; MOUSER_PRICE-STOCK: https://www.mouser.co.uk/ProductDetail/Panasonic/EVP-AA102K?qs=gEXKaSArNxxcUc0NKftbeA%3D%3D
SW4 = PCB_Components:EVP-AA102K: Black Push Plate Tact Switch, SPST 20 mA @ 15 V dc 2.2mm Surface Mount Source: Datasheet <https://industrial.panasonic.com/cdbs/www-data/pdf/ATK0000/ATK0000COS4238.pdf>; DESCRIPTION: Black Push Plate Tact Switch, SPST 20 mA @ 15 V dc 2.2mm Surface Mount; HEIGHT: 1.9mm; MANUFACTURER_NAME: Panasonic; MANUFACTURER_PART_NUMBER: EVP-AA102K; MOUSER_PART_NUMBER: 667-EVP-AA102K; MOUSER_PRICE-STOCK: https://www.mouser.co.uk/ProductDetail/Panasonic/EVP-AA102K?qs=gEXKaSArNxxcUc0NKftbeA%3D%3D
U1 = SamacSys_Parts:OVM7692-RYAA: Feature Rich VGA Camera Cube Chip Source: Datasheet <https://www.arrow.com/en/products/ovm7692-ryaa/omnivision-technologies>; DESCRIPTION: Feature Rich VGA Camera Cube Chip; HEIGHT: 2760.05mm; MANUFACTURER_NAME: OmniVision Technologies Inc; MANUFACTURER_PART_NUMBER: OVM7692-RYAA
U2 = MAX32625ITK+:MAX32625ITK+: ARM Microcontrollers - MCU ENTERPRISE ARM M4 32 BIT MICRO TQFN Source: Datasheet <https://datasheets.maximintegrated.com/en/ds/MAX32625-MAX32626.pdf>; DESCRIPTION: ARM Microcontrollers - MCU ENTERPRISE ARM M4 32 BIT MICRO TQFN; HEIGHT: 0.8mm; MANUFACTURER_NAME: Maxim Integrated; MANUFACTURER_PART_NUMBER: MAX32625ITK+; MOUSER_PART_NUMBER: 700-MAX32625ITK+; MOUSER_PRICE-STOCK: https://www.mouser.co.uk/ProductDetail/Maxim-Integrated/MAX32625ITK%2b?qs=gjT6naH6P5LAsx0I2pN3vw%3D%3D
U3 = RFM95W-868S2:RFM95W-868S2: Mod Txrx Lora +20dbm 868mhz Smd Check availability <https://pricing.snapeda.com/parts/RFM95W-868S2/RF/view-part?ref=eda>; AVAILABILITY: In Stock; DESCRIPTION: General ISM < 1GHz LoRa™ Transceiver Module 868MHz Antenna Not Included Surface Mount; MF: RF; MP: RFM95W-868S2; PACKAGE: SMD-16 Hope Microelectronics; PRICE: None; PURCHASE-URL: https://pricing.snapeda.com/search/part/RFM95W-868S2/?ref=eda
U4 = PCB_Components:MAX78000EXG+: ARM Microcontrollers - MCU ARM M4F w/ 432KB Weight CNN Accelerator, CTBGA Source: Datasheet <https://pdfserv.maximintegrated.com/en/ds/MAX78000.pdf>; DESCRIPTION: ARM Microcontrollers - MCU ARM M4F w/ 432KB Weight CNN Accelerator, CTBGA; HEIGHT: 1.3mm; MANUFACTURER_NAME: Maxim Integrated; MANUFACTURER_PART_NUMBER: MAX78000EXG+; MOUSER_PART_NUMBER: 700-MAX78000EXG+; MOUSER_PRICE-STOCK: https://www.mouser.co.uk/ProductDetail/Maxim-Integrated/MAX78000EXG%2b?qs=yqaQSyyJnNigS5t%2FKz0nhQ%3D%3D
U6 = SamacSys_Parts:MAX14595ETA+: Translation - Voltage Levels High-Speed Open Drain LLT Source: Datasheet <https://www.mouser.it/datasheet/2/256/MAX14595-471922.pdf>; DESCRIPTION: Translation - Voltage Levels High-Speed Open Drain LLT; HEIGHT: 0.8mm; MANUFACTURER_NAME: Maxim Integrated; MANUFACTURER_PART_NUMBER: MAX14595ETA+; MOUSER_PART_NUMBER: 700-MAX14595ETA+; MOUSER_PRICE-STOCK: https://www.mouser.co.uk/ProductDetail/Maxim-Integrated/MAX14595ETA%2b?qs=Or6ezLSzmEvDejm1TC8ZVA%3D%3D
U7 = SamacSys_Parts:MAX20303BEWN+: PMIC with Ultra Low IQ Voltage Regulators, Battery Charger and Fuel Gauge for Small Lithium Ion Systems, 56WLP Source: Datasheet <https://datasheets.maximintegrated.com/en/ds/MAX20303.pdf>; DESCRIPTION: PMIC with Ultra Low IQ Voltage Regulators, Battery Charger and Fuel Gauge for Small Lithium Ion Systems, 56WLP; HEIGHT: 0.69mm; MANUFACTURER_NAME: Maxim Integrated; MANUFACTURER_PART_NUMBER: MAX20303BEWN+; MOUSER_PART_NUMBER: 700-MAX20303BEWN+; MOUSER_PRICE-STOCK: https://www.mouser.co.uk/ProductDetail/Maxim-Integrated/MAX20303BEWN%2b?qs=1mbolxNpo8eN7uF1MmO5jA%3D%3D
U8 U10 = SamacSys_Parts:MAX38642AELT+T: Buck Switching Regulator IC Positive Adjustable 0.7V 1 Output 350mA 6-WDFN Source: Datasheet <https://datasheets.maximintegrated.com/en/ds/MAX38640-MAX38643.pdf>; DESCRIPTION: Buck Switching Regulator IC Positive Adjustable 0.7V 1 Output 350mA 6-WDFN; HEIGHT: 0.8mm; MANUFACTURER_NAME: Maxim Integrated; MANUFACTURER_PART_NUMBER: MAX38642AELT+T; MOUSER_PART_NUMBER: 700-MAX38642AELT+T; MOUSER_PRICE-STOCK: https://www.mouser.co.uk/ProductDetail/Maxim-Integrated/MAX38642AELT%2bT/?qs=BJlw7L4Cy7%252BFrjyvbQLS3g%3D%3D
U9 = SamacSys_Parts:N01S830HAT22I: ON Semiconductor SRAM, N01S830HAT22I- 1Mbit Source: Datasheet <https://www.onsemi.com/pub/Collateral/N01S830HA-D.PDF>; ARROW_PART_NUMBER: N01S830HAT22I; ARROW_PRICE-STOCK: https://www.arrow.com/en/products/n01s830hat22i/on-semiconductor; DESCRIPTION: ON Semiconductor SRAM, N01S830HAT22I- 1Mbit; HEIGHT: 1.1mm; MANUFACTURER_NAME: ON Semiconductor; MANUFACTURER_PART_NUMBER: N01S830HAT22I; MOUSER_PART_NUMBER: 863-N01S830HAT22I; MOUSER_PRICE-STOCK: https://www.mouser.com/Search/Refine.aspx?Keyword=863-N01S830HAT22I
U11 = SamacSys_Parts:MAX6817EUT+T: Supervisory Circuits Dual Switch Debouncer Source: Datasheet <http://datasheets.maximintegrated.com/en/ds/MAX6816-MAX6818.pdf>; DESCRIPTION: Supervisory Circuits Dual Switch Debouncer; HEIGHT: 1.45mm; MANUFACTURER_NAME: Maxim Integrated; MANUFACTURER_PART_NUMBER: MAX6817EUT+T; MOUSER_PART_NUMBER: 700-MAX6817EUTT; MOUSER_PRICE-STOCK: https://www.mouser.co.uk/ProductDetail/Maxim-Integrated/MAX6817EUT%2bT?qs=1THa7WoU59HkU%2FfQtsyW%252BA%3D%3D
U12 = PCB_Components:SN74LVC1G07DCKR: SINGLE BUFFER/DRIVER WITH OPEN-DRAIN OUTPUT Source: Datasheet <http://www.ti.com/lit/gpn/sn74lvc1g07>; ARROW_PART_NUMBER: SN74LVC1G07DCKR; ARROW_PRICE-STOCK: https://www.arrow.com/en/products/sn74lvc1g07dckr/texas-instruments?region=nac; DESCRIPTION: SINGLE BUFFER/DRIVER WITH OPEN-DRAIN OUTPUT; HEIGHT: 1.1mm; MANUFACTURER_NAME: Texas Instruments; MANUFACTURER_PART_NUMBER: SN74LVC1G07DCKR; MOUSER_PART_NUMBER: 595-SN74LVC1G07DCKR; MOUSER_PRICE-STOCK: https://www.mouser.co.uk/ProductDetail/Texas-Instruments/SN74LVC1G07DCKR?qs=EIjG%252BN7kn%252Bm5urWpZFTEPA%3D%3D
Y2 = SamacSys_Parts:ABS07-32.768KHZ-6-T: Crystal 0.032768MHz +/-20ppm (Tol) 6pF Flexural 70000Ohm 2-Pin CSMD T/R Source: Datasheet <https://abracon.com/Resonators/ABS07-LR.pdf>; ARROW_PART_NUMBER: ABS07-32.768KHZ-6-T; ARROW_PRICE-STOCK: https://www.arrow.com/en/products/abs07-32.768khz-6-t/abracon?region=nac; DESCRIPTION: Crystal 0.032768MHz +/-20ppm (Tol) 6pF Flexural 70000Ohm 2-Pin CSMD T/R; HEIGHT: 0.9mm; MANUFACTURER_NAME: ABRACON; MANUFACTURER_PART_NUMBER: ABS07-32.768KHZ-6-T; MOUSER_PART_NUMBER: 815-ABS07-32.768K6T; MOUSER_PRICE-STOCK: https://www.mouser.co.uk/ProductDetail/ABRACON/ABS07-32768KHZ-6-T?qs=Pyu0ZBy%2FIJYqrd93qMRCiw%3D%3D
Y3 = PCB_Components:ABS07-32.768KHZ-6-T: Crystal 0.032768MHz +/-20ppm (Tol) 6pF Flexural 70000Ohm 2-Pin CSMD T/R Source: Datasheet <https://abracon.com/Resonators/ABS07-LR.pdf>; ARROW_PART_NUMBER: ABS07-32.768KHZ-6-T; ARROW_PRICE-STOCK: https://www.arrow.com/en/products/abs07-32.768khz-6-t/abracon?region=nac; DESCRIPTION: Crystal 0.032768MHz +/-20ppm (Tol) 6pF Flexural 70000Ohm 2-Pin CSMD T/R; HEIGHT: 0.9mm; MANUFACTURER_NAME: ABRACON; MANUFACTURER_PART_NUMBER: ABS07-32.768KHZ-6-T; MOUSER_PART_NUMBER: 815-ABS07-32.768K6T; MOUSER_PRICE-STOCK: https://www.mouser.co.uk/ProductDetail/ABRACON/ABS07-32768KHZ-6-T?qs=Pyu0ZBy%2FIJYqrd93qMRCiw%3D%3D

## Module A
Ports: 

### Library data of the parts